# Altium schematic sheet Sheet1.SchDoc
size A4; SheetNumber: 1; SheetTotal: 1
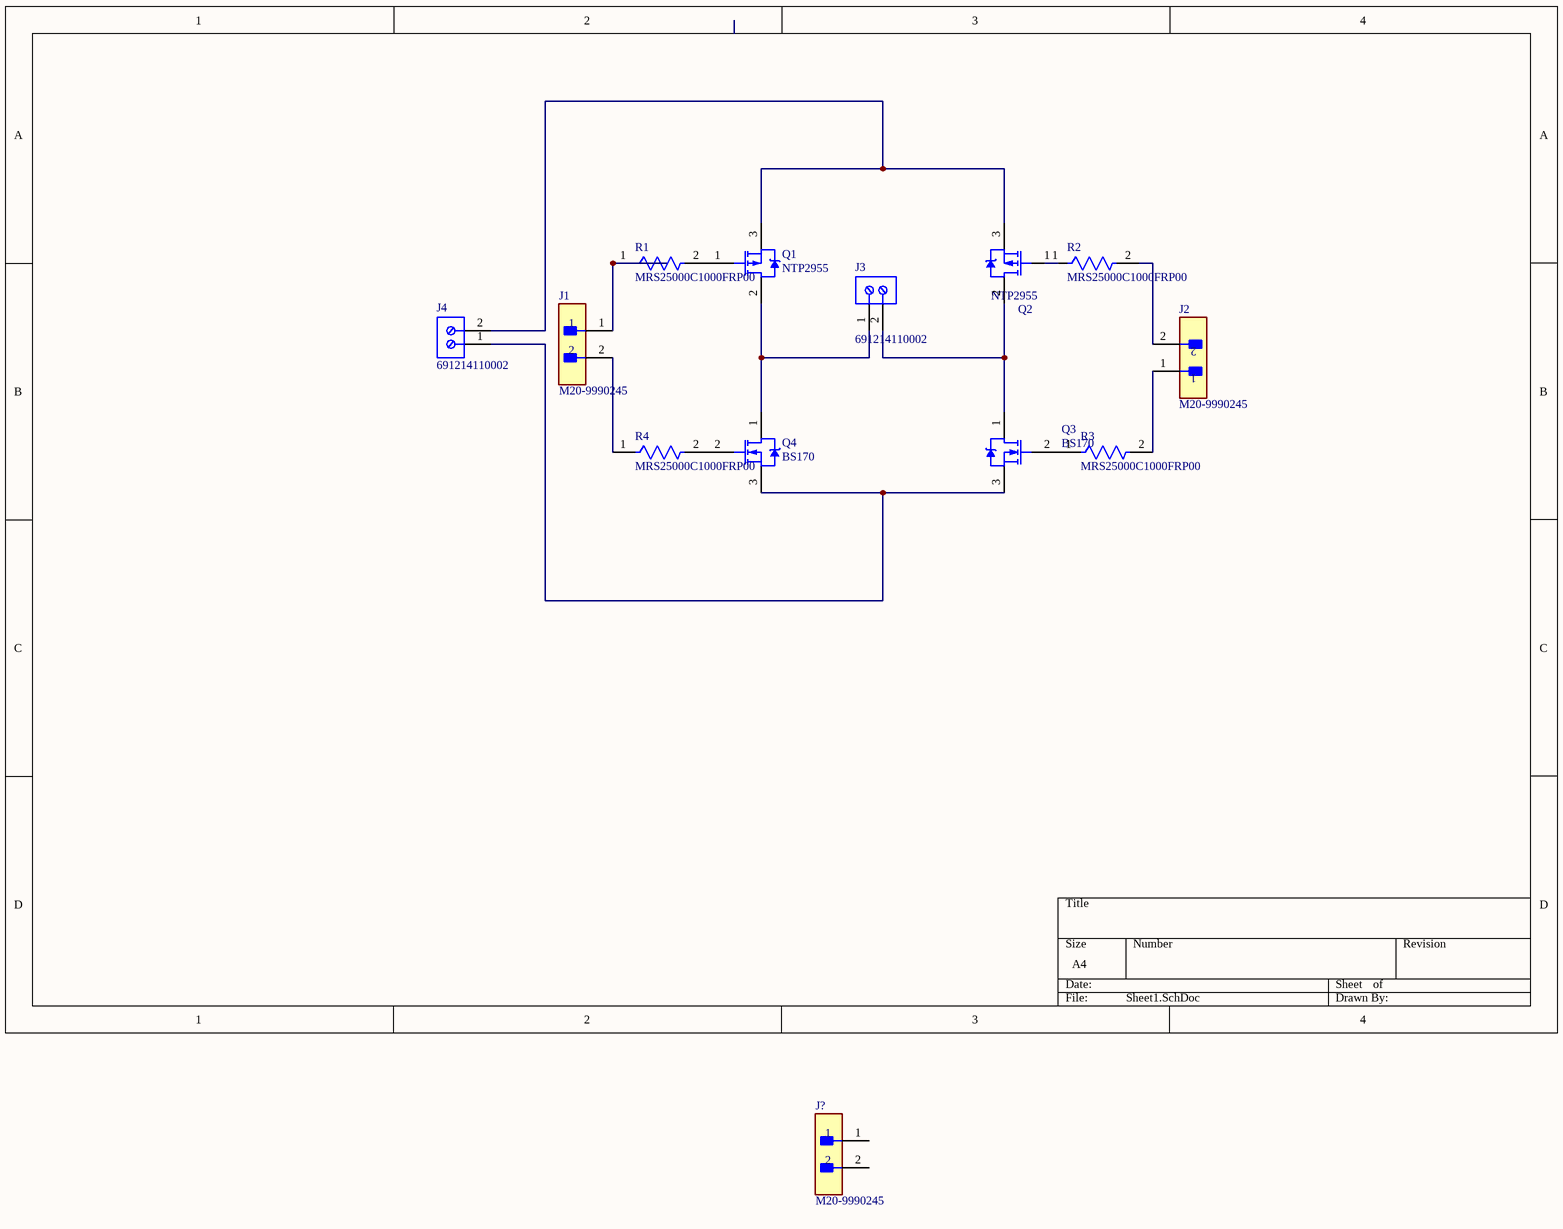
[diagram p0: Sheet1.SchDoc]

## Parts
J1  M20-9990245  [FP-M20-9990245-MFG]
J2  M20-9990245  [FP-M20-9990245-MFG]
J3  691214110002  [691214110002]
J4  691214110002  [691214110002]
J?  M20-9990245  [FP-M20-9990245-MFG]
Q1  NTP2955  [ONSC-TO-220-3-221A-09_AA]
Q2  NTP2955  [ONSC-TO-220-3-221A-09_AA]
Q3  BS170  [ONSC-TO-92-3-29-11]
Q4  BS170  [ONSC-TO-92-3-29-11]
R1  MRS25000C1000FRP00  [FP-MRS25-MFG]
R2  MRS25000C1000FRP00  [FP-MRS25-MFG]
R3  MRS25000C1000FRP00  [FP-MRS25-MFG]
R4  MRS25000C1000FRP00  [FP-MRS25-MFG]

## Nets
NetJ1_1: J1.1 R1.1
NetJ1_2: J1.2 R4.1
NetJ2_1: J2.1 R3.2
NetJ2_2: J2.2 R2.2
NetJ3_1: J3.1 Q1.2(D) Q4.1(D)
NetJ3_2: J3.2 Q2.2(D) Q3.1(D)
NetJ4_1: J4.1 Q3.3(S) Q4.3(S)
NetJ4_2: J4.2 Q1.3(S) Q2.3(S)
NetQ1_1: Q1.1(G) R1.2
NetQ2_1: Q2.1(G) R2.1
NetQ3_2: Q3.2(G) R3.1
NetQ4_2: Q4.2(G) R4.2

Not connected (* = marked no-connect by the designer): J? 1 2

## Library data of the parts
J1 J2 J? = CMP-15831-000105-1: CONN HEADER VERT 2POS 2.54MM; Working Voltage: 750V; Gender: Male; Number of Poles: 2; Current Rating: 3A; Mated Stacking Heights: 16.54mm; Contact Resistance: 25mR; Connector Type: Male Pin; Insulation Resistance: 10GR; Mating Cycles: 300; Voltage: 50V; Flammability Rating: UL94 V-0; Pitch: 2.54mm; Series: M20; Number of Contacts: 2; Height: 0.12inch; Min Operating Temperature: -40°C; Contact Finish - Mating: GOLD; Number of Positions: 2; Number of Rows: 1; Packaging: Bulk; Package Quantity: 1000; Voltage Rating (AC): 750V; Current: 3A; Mount: Through Hole; Case/Package: SIL; Orientation: Straight; Contact Shape: Square; Weight: 0.25lb; Radiation Hardening: No; Fastening Type: Pull; Length: 5.08mm; Depth: 2.54mm; Contact Mating Length: 0.24inch; Housing Material: Nylon; Reach SVHC Compliant: Yes; Insulation Material: Nylon; Color: Black; Width: 0.25inch; Insulation Color: Black; Contact Material: Brass; Contact Type: Male Pin; Termination: Solder; Max Operating Temperature: 105°C; Contact Plating: Gold; Housing Color: Black; Max Current Rating: 3A; Lead Pitch: 2.54mm
J3 J4 = CMP-1502-02464-2: NexarPartId: 18818288; Plating: Brass, Steel; Current: 10A; Pitch: 3.5052mm; Number of Levels: 1; Number of Contacts: 2; Wire Gauge (Min): 16AWG; Voltage: 300V; Wire Gauge (Max): 24AWG; Stripping Length: -6mm; Number of Pins: 2; Number of Rows: 1; REACH SVHC: Unknown; RoHS: Compliant; Housing Material: Nylon; Termination: Screw; Mount: Through Hole; Contact Plating: Brass, Tin; Number of Positions Per Level: 2; Color: Blue, Green; Width: 7.9mm; Voltage Rating: 300V; Length: 7.4mm; Current Rating: 10A; Wire/Cable Gauge: 24AWG; Packaging: Box; Max Operating Temperature: 105°C; Lead Pitch: 3.5mm; Height: 8.7mm; Contact Material: Brass; Min Operating Temperature: -40°C
Q1 Q2 = CMP-1058-00865-1: Power MOSFET, -60 V, -12 A, Single P-Channel, 3-Pin TO-220, Tube; Manufacturer: On Semiconductor; V(BR)DSS Min (V): 60; Channel Polarity: P Channel; VGS Max (V): 20; Ciss Typ (pF): 507; Crss Typ (pF): 48; VGS(th) Max (V): 4; Qrr Typ (nC): 126; Coss Typ (pF): 150; ID Max (A): 12; PackageDescription: 3-Pin Flange Mount, Vertical Straight Lead, Body 9.97 x 4.445 mm, Pitch 2.54 mm; DatasheetVersion: Rev. 2; Mounting Technology: Through Hole; ComponentLink1URL: http://www.onsemi.com/; PackageVersion: Rev. AA; PackageReference: TO-220-3-221A-09_AA; ComponentLink3URL: http://www.onsemi.com/pub_link/Collateral/MAC16C-D.PDF; ComponentLink2Description: Datasheet; ComponentLink1Description: Manufacturer URL; Configuration: Single; ComponentLink2URL: http://www.onsemi.cn/pub_link/Collateral/NTP2955-D.PDF; ComponentLink3Description: Package Specification; Packing: Tube; Package Type: TO-220-3; PartNumber: NTP2955
Q3 Q4 = CMP-1058-00929-1: Small Signal MOSFET, 500 mA, 60 V, N-Channel, 3-Pin TO-92, Bulk Box; Manufacturer: On Semiconductor; VGS Max (V): 20; Configuration: Single; PD Max (W): 0.35; VGS(th) Max (V): 3; ID Max (A): 0.5; V(BR)DSS Min (V): 60; Channel Polarity: N Channel; PackageDescription: 3-Pin Transistor Outline, Body 4.825 x 3.685 mm, Pitch 1.27 mm; Package Type: TO-92; ComponentLink1Description: Manufacturer URL; ComponentLink1URL: http://www.onsemi.com/; DatasheetVersion: Rev. 6; ComponentLink3Description: Package Specification; PartNumber: BS170; ComponentLink2URL: http://www.onsemi.com/pub_link/Collateral/BS170-D.PDF; PackageVersion: Rev. AM; Mounting Technology: Through Hole; PackageReference: TO-92-3-29-11_AM_SL; ComponentLink2Description: Datasheet; ComponentLink3URL: http://www.onsemi.cn/pub_link/Collateral/2N6426-D.PDF; Packing: Bulk Box
R1-R4 = CMP-00030-42757237-1: MRS25000C1000FRP00 Resistor, 100 Ohm, ± 1%, 600 mW, Axial Leaded, Metal Film (Thin Film), Professional; Max Power Dissipation: 600mW; Resistance: 100Ω; Voltage Rating: 350V; Temperature Coefficient: 50ppm/°C; Lead Diameter: 600µm; RoHS: Compliant; Radiation Hardening: No; Schedule B: 8533210090, 8533210090; Length: 6.5mm; Packaging: Tape & Reel (TR); Number of Terminations: 2; Mount: Through Hole; Width: 2.5mm; Tolerance: 1%; Military Standard: Not; Voltage Rating (DC): 350V; Contact Plating: Tin; Number of Pins: 2; Max Operating Temperature: 155°C; NexarPartId: 42757237; Diameter: 2.5mm; Composition: Metal Film, Thin Film; REACH SVHC: Unknown; Power Rating: 600mW; Lead Free: Lead Free; Termination: Axial; Case/Package: Axial; Min Operating Temperature: -55°C